# EAGLE schematic PiCB (EAGLE 7.7.0)
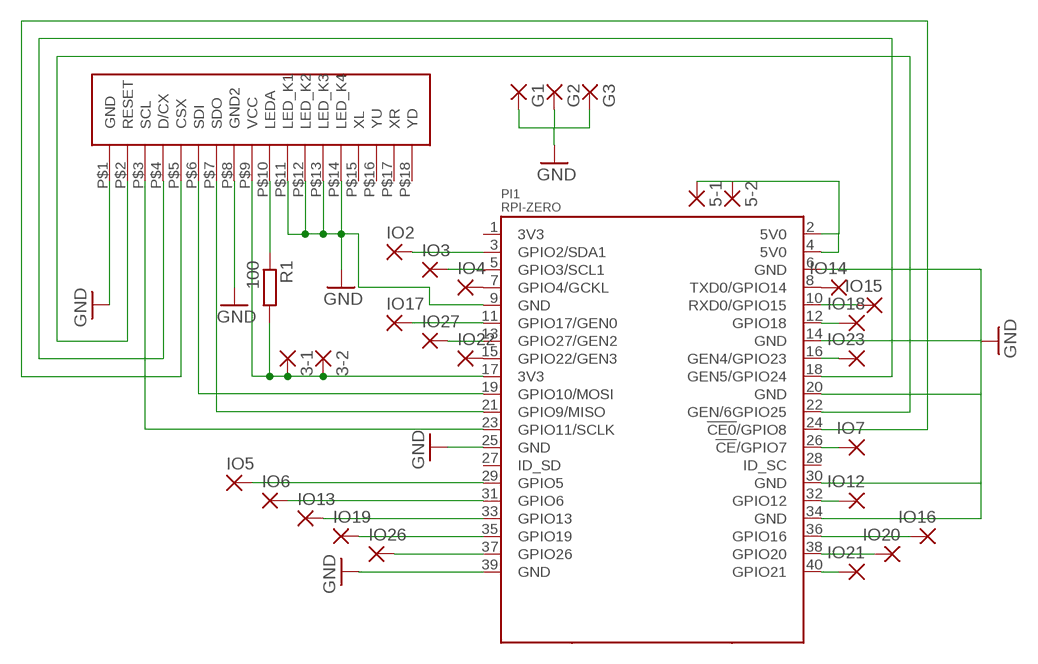
[diagram p0: schematic, sheet 1]

## Parts
3-1  1,6/0,8  [1,6/0,8]
3-2  1,6/0,8  [1,6/0,8]
5-1  1,6/0,8  [1,6/0,8]
5-2  1,6/0,8  [1,6/0,8]
G1  1,6/0,8  [1,6/0,8]
G2  1,6/0,8  [1,6/0,8]
G3  1,6/0,8  [1,6/0,8]
IO2  1,6/0,8  [1,6/0,8]
IO3  1,6/0,8  [1,6/0,8]
IO4  1,6/0,8  [1,6/0,8]
IO5  1,6/0,8  [1,6/0,8]
IO6  1,6/0,8  [1,6/0,8]
IO7  1,6/0,8  [1,6/0,8]
IO12  1,6/0,8  [1,6/0,8]
IO13  1,6/0,8  [1,6/0,8]
IO14  1,6/0,8  [1,6/0,8]
IO15  1,6/0,8  [1,6/0,8]
IO16  1,6/0,8  [1,6/0,8]
IO17  1,6/0,8  [1,6/0,8]
IO18  1,6/0,8  [1,6/0,8]
IO19  1,6/0,8  [1,6/0,8]
IO20  1,6/0,8  [1,6/0,8]
IO21  1,6/0,8  [1,6/0,8]
IO22  1,6/0,8  [1,6/0,8]
IO23  1,6/0,8  [1,6/0,8]
IO26  1,6/0,8  [1,6/0,8]
IO27  1,6/0,8  [1,6/0,8]
PI1  RPI-ZERO  [RASPBERRYPI_BASTELSTUBE_V13_RASPI_BOARD_B+_FULL]
R1  100  R-EU_R0805  [R0805]
U$2  ILI9341-2.8  [ILI9341-2.8]

## Nets
5V0@2: 5-1.1(P) 5-2.1(P) PI1.2(5V0) PI1.4(5V0)
GND: G1.1(P) G2.1(P) G3.1(P) PI1.39(GND) U$2.P$1(GND) U$2.P$8(GND2)
GND@1: PI1.9(GND) U$2.P$11(LED_K1) U$2.P$12(LED_K2) U$2.P$13(LED_K3) U$2.P$14(LED_K4) ; supply symbol labelled GND
GND@2: PI1.25(GND) ; supply symbol labelled GND
GND@7: PI1.6(GND) PI1.14(GND) PI1.20(GND) PI1.30(GND) PI1.34(GND) ; supply symbol labelled GND
N$1: PI1.22(GEN/6GPIO25) U$2.P$2(RESET)
N$2: PI1.23(GPIO11/SCLK) U$2.P$3(SCL)
N$3: PI1.19(GPIO10/MOSI) U$2.P$6(SDI)
N$4: PI1.21(GPIO9/MISO) U$2.P$7(SDO)
N$5: R1.1 U$2.P$10(LEDA)
N$6: PI1.18(GEN5/GPIO24) U$2.P$4(D/CX)
N$7: PI1.24(!CE0!/GPIO8) U$2.P$5(CSX)
N$8: IO26.1(P) PI1.37(GPIO26)
N$9: IO19.1(P) PI1.35(GPIO19)
N$10: IO13.1(P) PI1.33(GPIO13)
N$11: IO6.1(P) PI1.31(GPIO6)
N$12: IO5.1(P) PI1.29(GPIO5)
N$13: IO21.1(P) PI1.40(GPIO21)
N$14: IO20.1(P) PI1.38(GPIO20)
N$15: IO16.1(P) PI1.36(GPIO16)
N$16: IO12.1(P) PI1.32(GPIO12)
N$17: IO7.1(P) PI1.26(!CE!/GPIO7)
N$18: IO14.1(P) PI1.8(TXD0/GPIO14)
N$19: 3-1.1(P) 3-2.1(P) PI1.17(3V3) R1.2 U$2.P$9(VCC)
N$20: IO23.1(P) PI1.16(GEN4/GPIO23)
N$21: IO18.1(P) PI1.12(GPIO18)
N$22: IO15.1(P) PI1.10(RXD0/GPIO15)
N$23: IO22.1(P) PI1.15(GPIO22/GEN3)
N$24: IO4.1(P) PI1.7(GPIO4/GCKL)
N$25: IO27.1(P) PI1.13(GPIO27/GEN2)
N$26: IO17.1(P) PI1.11(GPIO17/GEN0)
N$27: IO3.1(P) PI1.5(GPIO3/SCL1)
N$28: IO2.1(P) PI1.3(GPIO2/SDA1)
Unconnected: PI1.1(3V3) PI1.27(ID_SD) PI1.28(ID_SC) U$2.P$15(XL) U$2.P$16(YU) U$2.P$17(XR) U$2.P$18(YD)

## Library data of the parts
3-1 3-2 5-1 5-2 G1-G3 IO2-IO7 IO12-IO23 IO26 IO27 = wirepad:1,6/0,8: THROUGH-HOLE PAD
PI1 = RPI-Zero:RPI-ZERO
R1 = resistor:R-EU_: RESISTOR, European symbol
U$2 = ili9341:ILI9341-2.8